# EAGLE design quadcopter_sch (EAGLE 7.7.0)
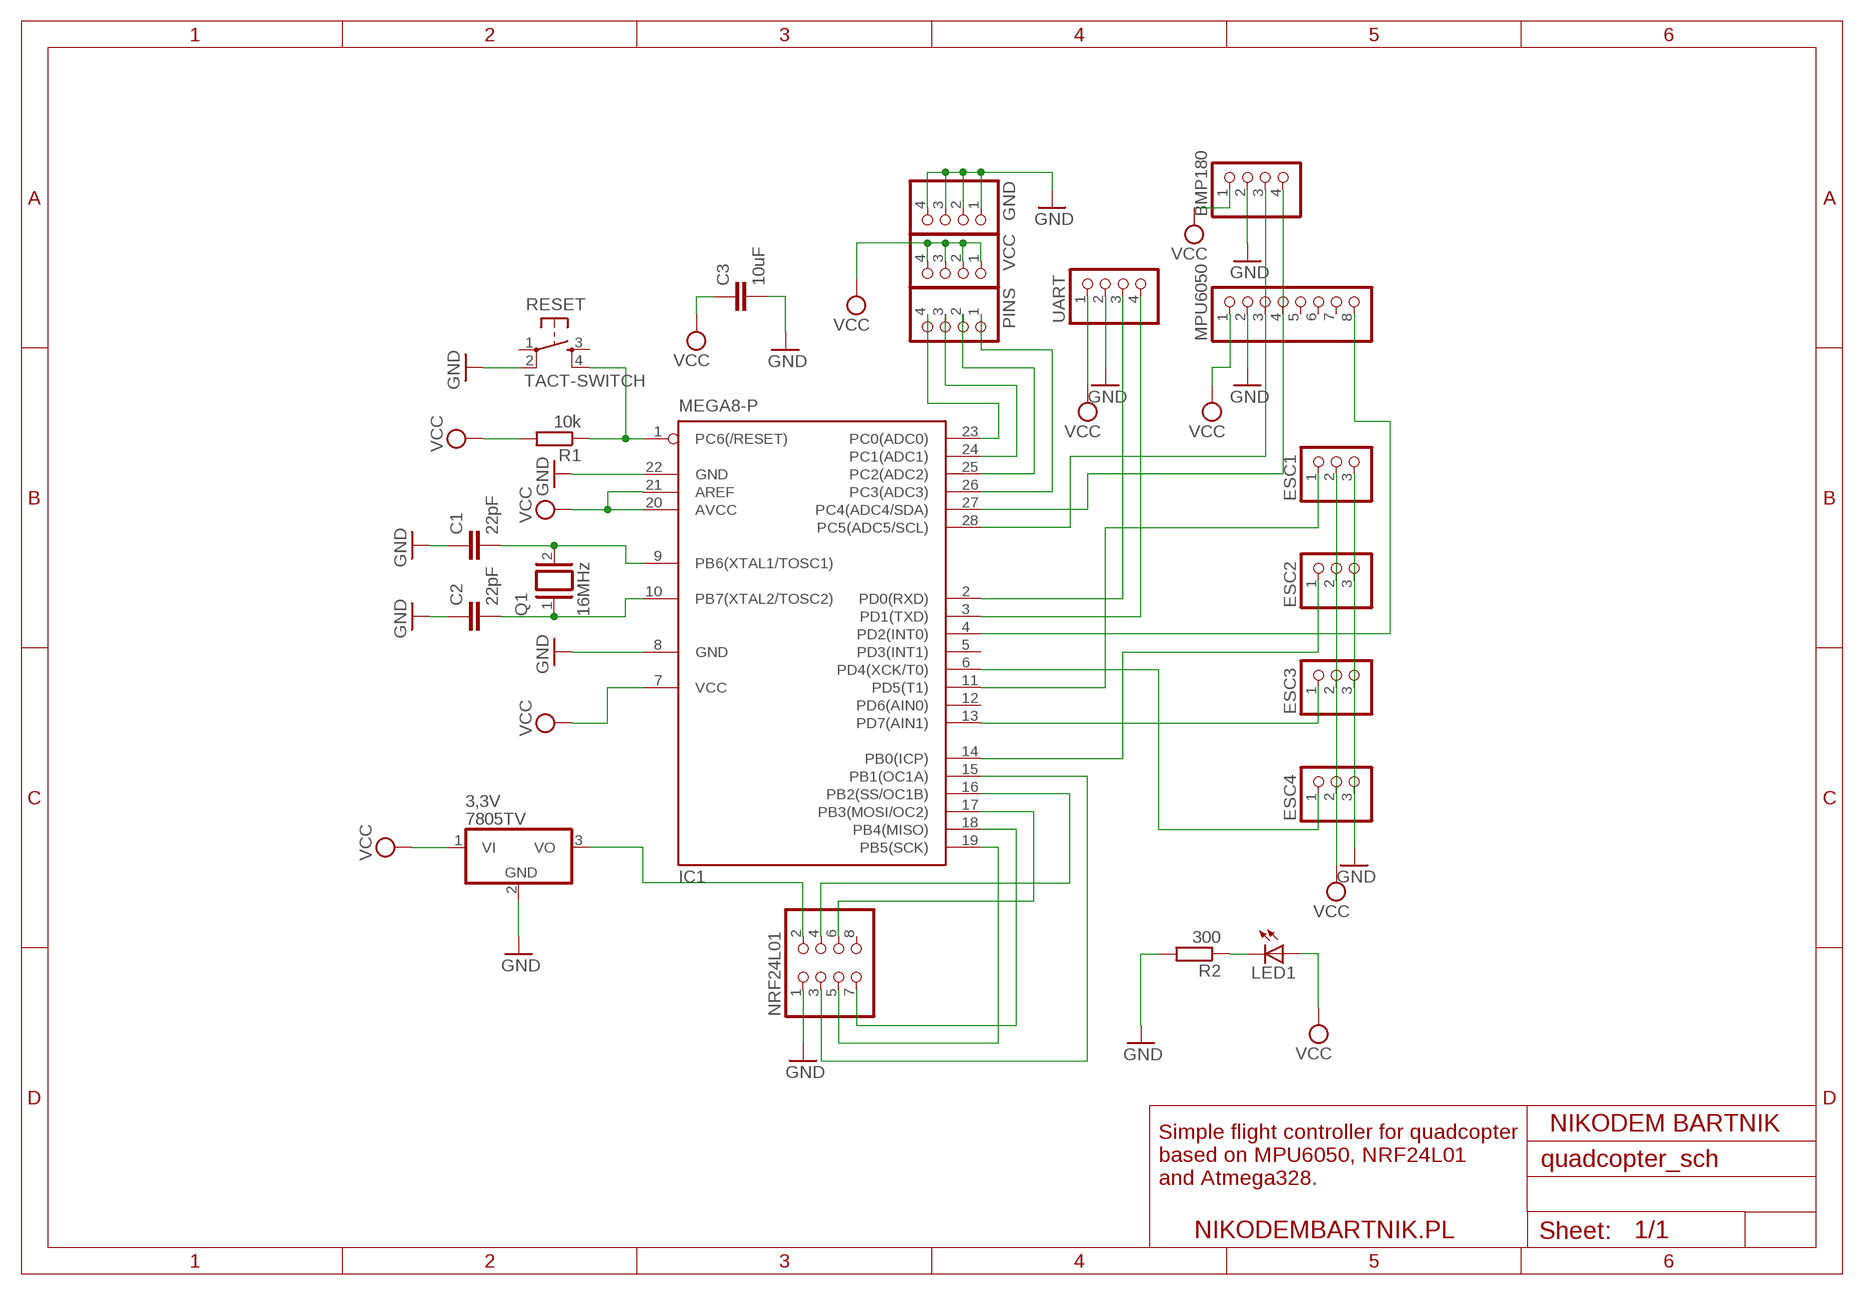
[diagram p0: schematic, sheet 1]

## Parts
3,3V  7805TV  [TO220V]
BMP180  PINHD-1X4  [1X04]
C1  22pF  C2,5-3  [C2.5-3]
C2  22pF  C2,5-3  [C2.5-3]
C3  10uF  C2,5-3  [C2.5-3]
ESC1  PINHD-1X3  [1X03]
ESC2  PINHD-1X3  [1X03]
ESC3  PINHD-1X3  [1X03]
ESC4  PINHD-1X3  [1X03]
GND  PINHD-1X4  [1X04]
IC1  MEGA8-P  [DIL28-3]
LED1  LED5MM  [LED5MM]
MPU6050  PINHD-1X8  [1X08]
NRF24L01  PINHD-2X4  [2X04]
PINS  PINHD-1X4  [1X04]
Q1  16MHz  XTAL/S  [QS]
R1  10k  R-EU_0204/2V  [0204V]
R2  300  R-EU_0204/2V  [0204V]
RESET  TACT-SWITCH  TACTILE-SWITCH-PTH  [TAC-SWITCH-PTH]
UART  PINHD-1X4  [1X04]
VCC  PINHD-1X4  [1X04]

## Nets
GND: 3,3V.2(GND) BMP180.2 C1.1 C2.1 C3.2 ESC1.3 ESC2.3 ESC3.3 ESC4.3 GND.1 GND.2 GND.3 GND.4 IC1.8(GND) IC1.22(GND) MPU6050.2 NRF24L01.1 R2.2 RESET.2 UART.2
N$1: IC1.1(PC6(/RESET)) R1.1 RESET.4
N$2: C1.2 IC1.9(PB6(XTAL1/TOSC1)) Q1.2
N$3: C2.2 IC1.10(PB7(XTAL2/TOSC2)) Q1.1
N$4: IC1.2(PD0(RXD)) UART.3
N$5: ESC1.1 IC1.11(PD5(T1))
N$6: ESC2.1 IC1.14(PB0(ICP))
N$7: ESC3.1 IC1.13(PD7(AIN1))
N$8: ESC4.1 IC1.6(PD4(XCK/T0))
N$9: IC1.3(PD1(TXD)) UART.4
N$10: BMP180.4 IC1.27(PC4(ADC4/SDA)) MPU6050.4
N$11: BMP180.3 IC1.28(PC5(ADC5/SCL)) MPU6050.3
N$12: IC1.4(PD2(INT0)) MPU6050.8
N$13: IC1.23(PC0(ADC0)) PINS.4
N$14: IC1.24(PC1(ADC1)) PINS.3
N$15: 3,3V.3(VO) NRF24L01.2
N$16: IC1.17(PB3(MOSI/OC2)) NRF24L01.6
N$17: IC1.18(PB4(MISO)) NRF24L01.7
N$18: IC1.19(PB5(SCK)) NRF24L01.5
N$19: IC1.15(PB1(OC1A)) NRF24L01.3
N$20: IC1.16(PB2(SS/OC1B)) NRF24L01.4
N$21: IC1.25(PC2(ADC2)) PINS.2
N$22: IC1.26(PC3(ADC3)) PINS.1
N$26: LED1.K(C) R2.1
VCC: 3,3V.1(VI) BMP180.1 C3.1 ESC1.2 ESC2.2 ESC3.2 ESC4.2 IC1.7(VCC) IC1.20(AVCC) IC1.21(AREF) LED1.A MPU6050.1 R1.2 UART.1 VCC.1 VCC.2 VCC.3 VCC.4
Unconnected: IC1.5(PD3(INT1)) IC1.12(PD6(AIN0)) MPU6050.5 MPU6050.6 MPU6050.7 NRF24L01.8 RESET.1 RESET.3

## Notes on the sheet
- NIKODEM BARTNIK
- Simple flight controller for quadcopter 
  based on MPU6050, NRF24L01
  and Atmega328.
- NIKODEMBARTNIK.PL

## Library data of the parts
3,3V = linear:78*: Positive VOLTAGE REGULATOR Source: http://cache.national.com/ds/LM/LM78L05.pdf http://www.fairchildsemi.com/ds/LM/LM7805.pdf
BMP180 GND PINS UART VCC = pinhead:PINHD-1X4: PIN HEADER
C1-C3 = capacitor-wima:C: CAPACITOR naming: grid - package width
ESC1-ESC4 = pinhead:PINHD-1X3: PIN HEADER
IC1 = atmel:MEGA8-P: MICROCONTROLLER 8 Kbytes FLASH, 1 kbytes SRAM, 512 bytes EEPROM, USART, 4-channel 10 bit ADC, 2-channel 8 bit ADC Pin compatible with Atmega48, ATMega88, ATMega168 Source: avr.lbr; OC_FARNELL: unknown; OC_NEWARK: unknown
LED1 = led:LED: LED OSRAM: - CHIPLED LG R971, LG N971, LY N971, LG Q971, LY Q971, LO R971, LY R971 LH N974, LH R974 LS Q976, LO Q976, LY Q976 LO Q996 - Hyper CHIPLED LW Q18S LB Q993, LB Q99A, LB R99A - SideLED LS A670, LO A670, LY A670, LG A670, LP A670 LB A673, LV A673, LT A673, LW A673 LH A674 LY A675 LS A676, LA A676, LO A676, LY A676, LW A676 LS A679, LY A679, LG A679 - Hyper Micro SIDELED® LS Y876, LA Y876, LO Y876, LY Y876 LT Y87S - SmartLED LW L88C, LW L88S LB L89C, LB L89S, LG L890 LS L89K, LO L89K, LY L89K LS L896, LA L896, LO L896, LY L896 - TOPLED LS T670, LO T670, LY T670, LG T670, LP T670 LSG T670, LSP T670, LSY T670, LOP T670, LYG T670 LG T671, LOG T671, LSG T671 LB T673, LV T673, LT T673, LW T673 LH T674 LS T676, LA T676, LO T676, LY T676, LB T676, LH T676, LSB T676, LW T676 LB T67C, LV T67C, LT T67C, LS T67K, LO T67K, LY T67K, LW E67C LS E67B, LA E67B, LO E67B, LY E67B, LB E67C, LV E67C, LT E67C LW T67C LS T679, LY T679, LG T679 LS T770, LO T770, LY T770, LG T770, LP T770 LB T773, LV T773, LT T773, LW T773 LH T774 LS E675, LA E675, LY E675, LS T675 LS T776, LA T776, LO T776, LY T776, LB T776 LHGB T686 LT T68C, LB T68C - Hyper Mini TOPLED® LB M676 - Mini TOPLED Santana® LG M470 LS M47K, LO M47K, LY M47K Source: http://www.osram.convergy.de LUXEON: - LUMILED® LXK2-PW12-R00, LXK2-PW12-S00, LXK2-PW14-U00, LXK2-PW14-V00 LXK2-PM12-R00, LXK2-PM12-S00, LXK2-PM14-U00 LXK2-PE12-Q00, LXK2-PE12-R00, LXK2-PE12-S00, LXK2-PE14-T00, LXK2-PE14-U00 LXK2-PB12-K00, LXK2-PB12-L00, LXK2-PB12-M00, LXK2-PB14-N00, LXK2-PB14-P00, LXK2-PB14-Q00 LXK2-PR12-L00, LXK2-PR12-M00, LXK2-PR14-Q00, LXK2-PR14-R00 LXK2-PD12-Q00, LXK2-PD12-R00, LXK2-PD12-S00 LXK2-PH12-R00, LXK2-PH12-S00 LXK2-PL12-P00, LXK2-PL12-Q00, LXK2-PL12-R00 Source: www.luxeon.com KINGBRIGHT: KA-3528ASYC Source: www.kingbright.com
MPU6050 = pinhead:PINHD-1X8: PIN HEADER
NRF24L01 = pinhead:PINHD-2X4: PIN HEADER
Q1 = special:XTAL/S: CRYSTAL
R1 R2 = resistor:R-EU_: RESISTOR, European symbol
RESET = GeekAmmo:TACTILE-SWITCH: Tactile Switch 4 Pins, SPST NO

## Net classes
0 default: width 0.381 mm, clearance 0.381 mm

## Board
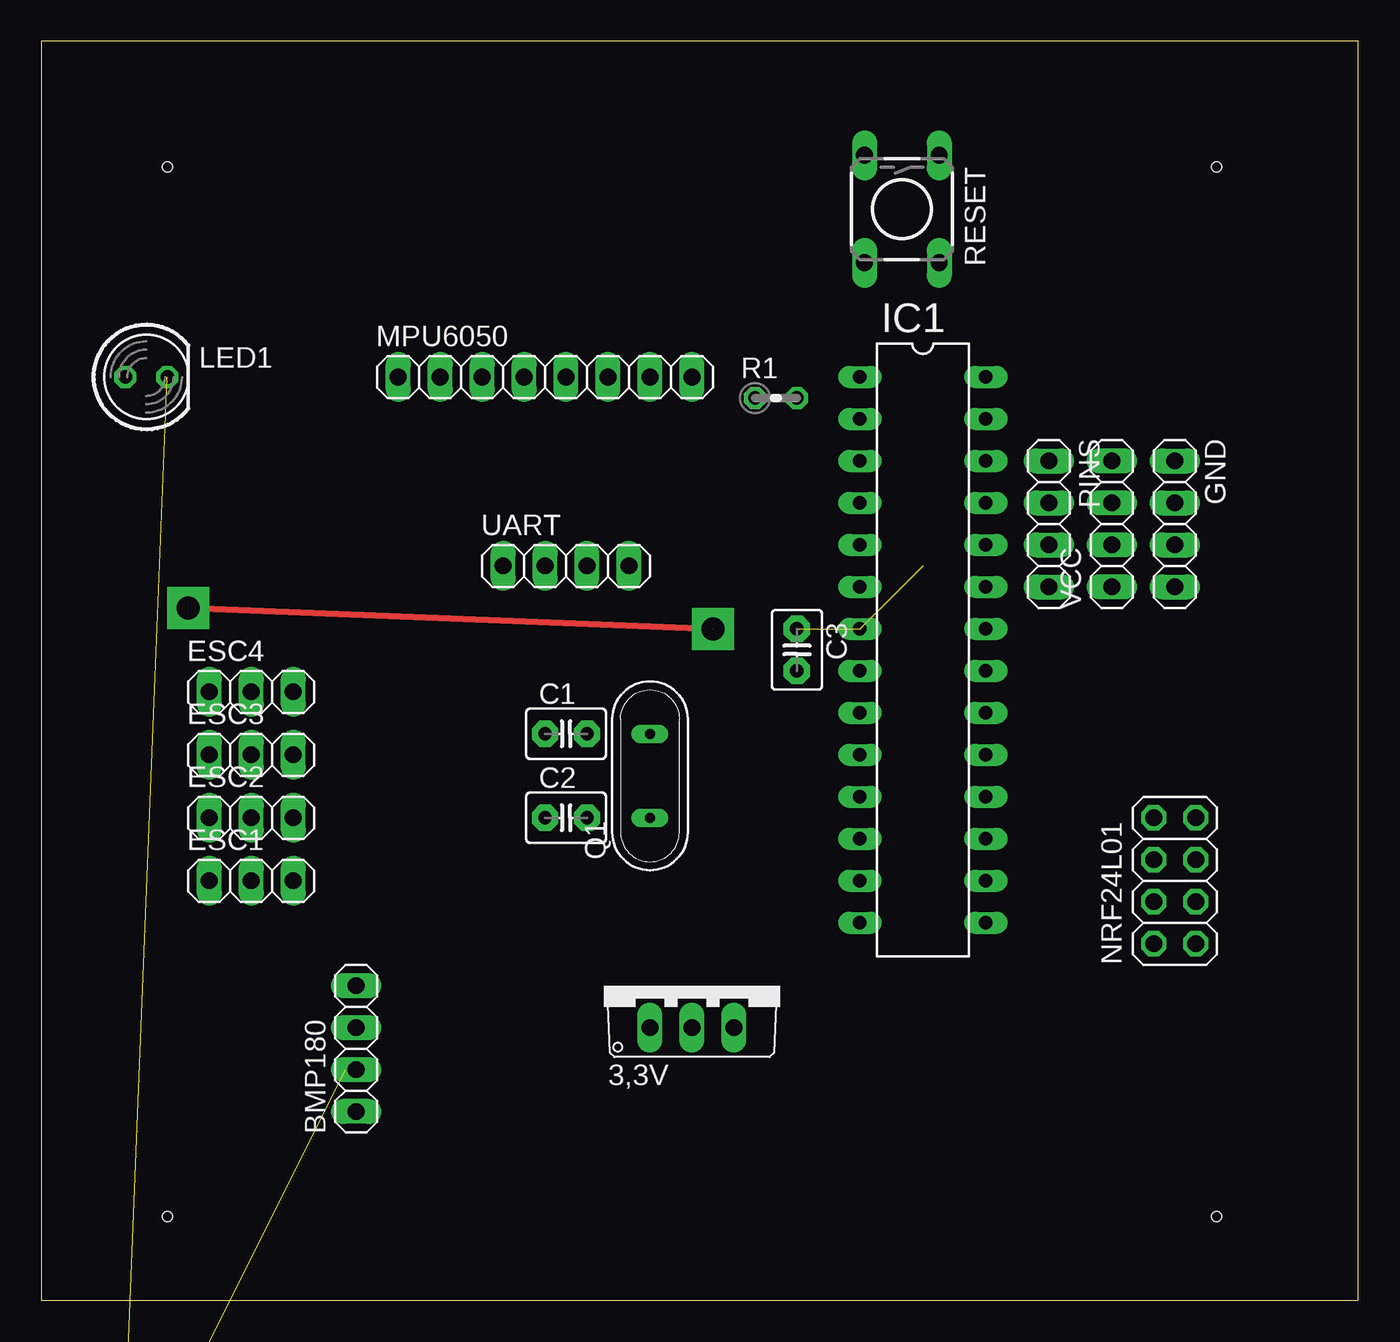
[diagram p1: board, top side]
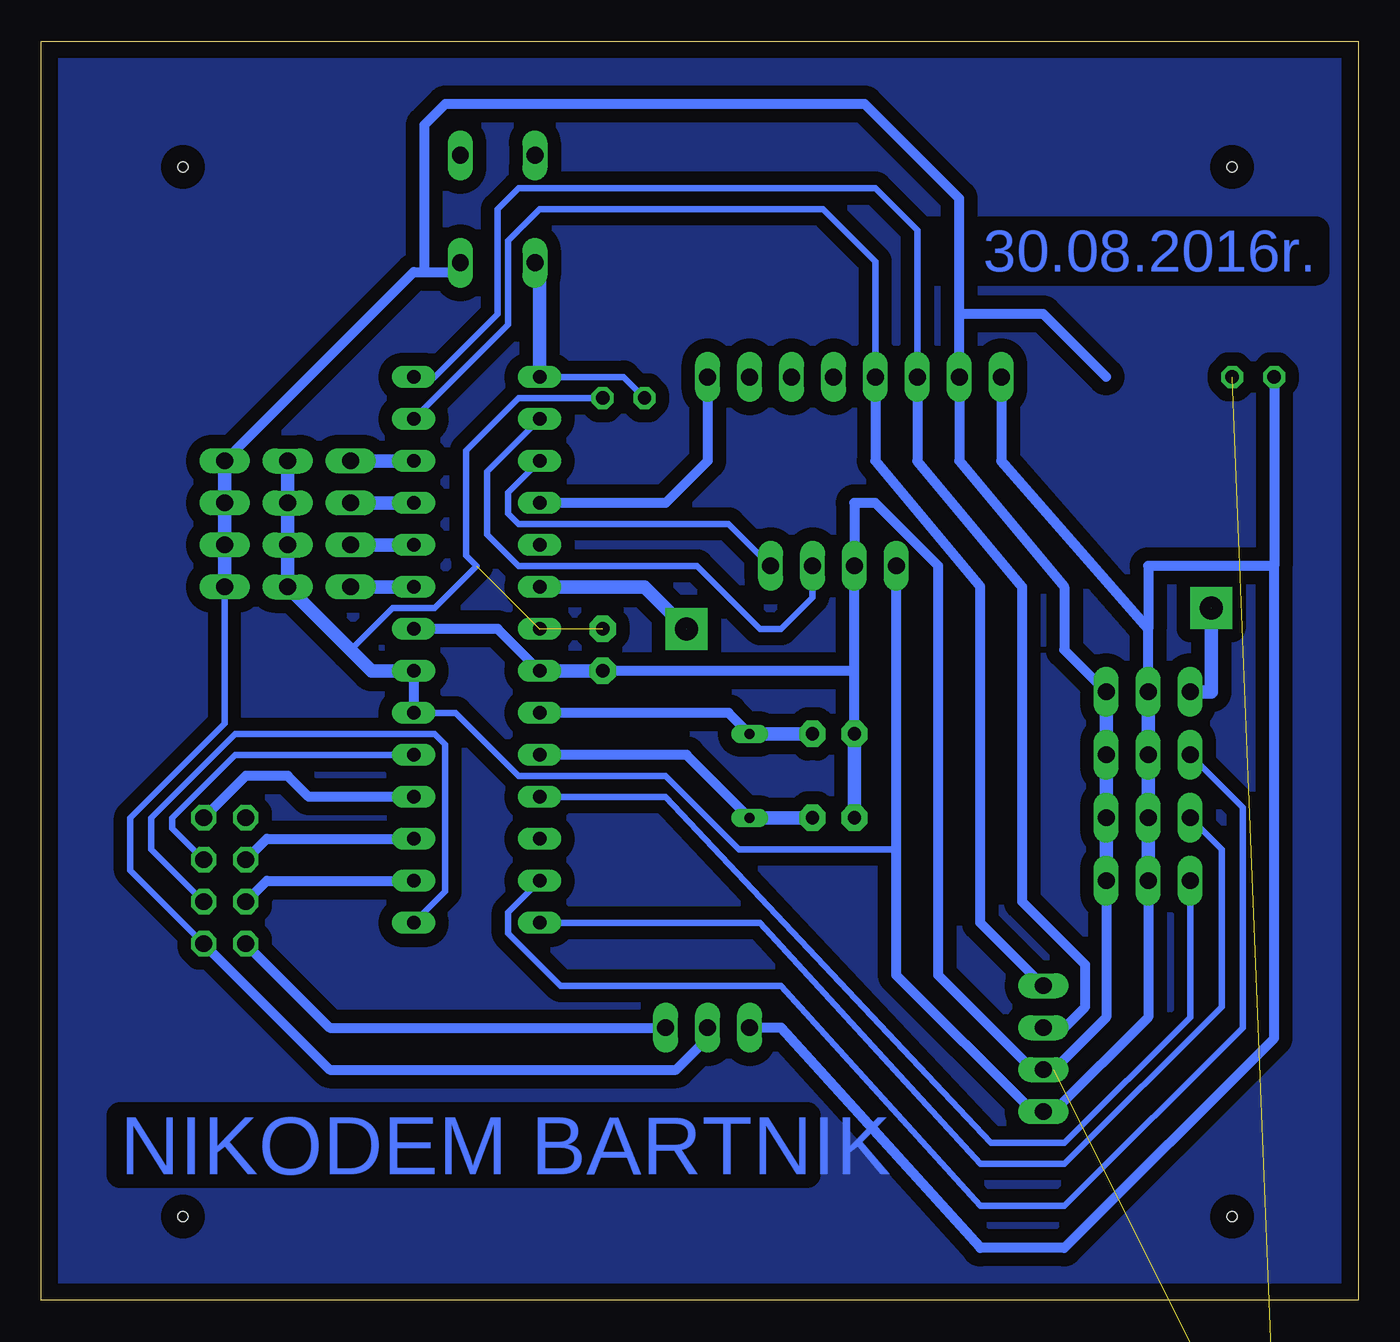
[diagram p2: board, bottom side, seen from below]

Size 79.68 x 76.19 mm. Coordinates in mm from the lower left corner, seen from the top.
Outline: 0,0 79.68,0 79.68,76.19 0,76.19 0,0
Copper layers (1*16): Top 0.035mm / dielectric 1.5mm / Bottom 0.035mm
Design rules "default": minimum track width 10mil, minimum drill 24mil, track to track 8mil, track to pad 8mil, pad to pad 8mil, via to via 8mil, smd to smd 8mil, copper to edge 40mil, drill to drill 8mil, minimum pad ring 10mil, minimum via ring 8mil, stop-mask expansion 4mil, vias tented up to drill 0mil, thermal gap 10mil
Holes 0.6 mm at 7.62,68.58 71.12,68.58 7.62,5.08 71.12,5.08

### Footprints (pad centres in the part's own frame; a part is rotated, then mirrored left to right if it is on the bottom)
TO220V = drill 1.016 long: 1 -2.54,-2.54; 2 0,-2.54; 3 2.54,-2.54
1X04 = drill 1.016 long: 1 -3.81,0; 2 -1.27,0; 3 1.27,0; 4 3.81,0
C2.5-3 = drill 0.813 pad 1.6 octagon: 1 -1.27,0; 2 1.27,0
1X03 = drill 1.016 long: 1 -2.54,0; 2 0,0; 3 2.54,0
DIL28-3 = drill 0.813 long: 1 -16.51,-3.81; 2 -13.97,-3.81; 3 -11.43,-3.81; 4 -8.89,-3.81; 5 -6.35,-3.81; 6 -3.81,-3.81; 7 -1.27,-3.81; 8 1.27,-3.81; 9 3.81,-3.81; 10 6.35,-3.81; 11 8.89,-3.81; 12 11.43,-3.81; 13 13.97,-3.81; 14 16.51,-3.81; 15 16.51,3.81; 16 13.97,3.81; 17 11.43,3.81; 18 8.89,3.81; 19 6.35,3.81; 20 3.81,3.81; 21 1.27,3.81; 22 -1.27,3.81; 23 -3.81,3.81; 24 -6.35,3.81; 25 -8.89,3.81; 26 -11.43,3.81; 27 -13.97,3.81; 28 -16.51,3.81
LED5MM = drill 0.813 octagon: A -1.27,0; K 1.27,0
1X08 = drill 1.016 long: 1 -8.89,0; 2 -6.35,0; 3 -3.81,0; 4 -1.27,0; 5 1.27,0; 6 3.81,0; 7 6.35,0; 8 8.89,0
2X04 = drill 1.016 octagon: 1 -3.81,-1.27; 2 -3.81,1.27; 3 -1.27,-1.27; 4 -1.27,1.27; 5 1.27,-1.27; 6 1.27,1.27; 7 3.81,-1.27; 8 3.81,1.27
QS = drill 0.61 long: 1 -2.54,0; 2 2.54,0
0204V = drill 0.813 octagon: 1 -1.27,0; 2 1.27,0
TAC-SWITCH-PTH = drill 1.016 pad 1.524 long: 1 -3.251,2.261; 2 3.251,2.261; 3 -3.251,-2.261; 4 3.251,-2.261

### Placement (x,y rotation side)
3,3V  39.37,19.05 0 top
BMP180  19.05,15.24 90 top
C1  31.75,34.29 0 top
C2  31.75,29.21 0 top
C3  45.72,39.37 270 top
ESC1  12.7,25.4 0 top
ESC2  12.7,29.21 0 top
ESC3  12.7,33.02 0 top
ESC4  12.7,36.83 0 top
GND  68.58,46.99 270 top
IC1  53.34,39.37 270 top
LED1  6.35,55.88 0 top
MPU6050  30.48,55.88 0 top
NRF24L01  68.58,25.4 90 top
PINS  60.96,46.99 270 top
Q1  36.83,31.75 90 top
R1  44.45,54.61 0 top
R2  6.35,-7.62 0 top  (outside the outline)
RESET  52.07,66.04 270 top
UART  31.75,44.45 0 top
VCC  64.77,46.99 90 top

### Tracks (layer width: path | path; a pad name or v marks a point on that pad's centre or on a via)
GND  (1 unrouted)
  Bottom 0.381: GND.4 68.58,34.92 74.3,29.21 74.3,26.03 NRF24L01.1 | 30.48,43.81 UART.2
  Bottom 0.61: 56.52,62.23 57.15,62.23 GND.1 | 56.52,62.23 54.61,62.23 RESET.2 | 3,3V.2 39.37,15.88 41.28,13.97 62.23,13.97 NRF24L01.1 | IC1.22 52.07,40.64 IC1.8 | C1.1 30.48,38.1 | 30.48,38.1 UART.2 30.48,48.26 29.21,48.26 25.4,44.45 25.4,19.69 19.68,13.97 BMP180.2 18.41,13.97 15.24,17.14 ESC1.3 | 30.48,38.1 C3.2 | 56.52,62.23 56.52,71.12 55.25,72.39 29.85,72.39 24.13,66.67 24.13,59.69 | 24.13,59.69 MPU6050.2 24.13,50.8 17.78,43.18 17.78,39.37 ESC4.3 | 15.24,55.88 19.05,59.69 24.13,59.69
  Bottom 0.813: GND.4 GND.3 GND.2 GND.1 | C3.2 IC1.8 | C1.1 C2.1 | ESC1.3 ESC2.3 ESC3.3 ESC4.3
N$1
  Bottom 0.381: R1.1 44.45,55.88 IC1.1
  Bottom 0.813: IC1.1 49.53,62.23 RESET.4
N$2
  Bottom 0.61: IC1.9 38.1,35.56 Q1.2
  Bottom 0.813: C1.2 Q1.2
N$3
  Bottom 0.61: IC1.10 40.64,33.02 Q1.1
  Bottom 0.813: C2.2 Q1.1
N$4
  Bottom 0.381: IC1.2 52.71,50.16 52.71,46.35 50.8,44.45 40.01,44.45 36.2,40.64 34.93,40.64 33.02,42.55 UART.3
N$5
  Bottom 0.381: IC1.11 41.91,30.48 22.22,9.53 17.78,9.53 10.16,17.14 ESC1.1
N$6
  Bottom 0.381: IC1.14 36.2,22.86 22.86,8.25 17.78,8.25 8.25,17.78 8.25,27.3 ESC2.1
N$7
  Bottom 0.381: IC1.13 51.44,23.49 51.44,22.23 48.26,19.05 34.93,19.05 22.86,5.71 17.78,5.71 6.99,16.51 6.99,29.84 ESC3.1
N$8  (2 unrouted)
  Top 0.406: 40.64,40.64 8.89,41.91
  Bottom 0.813: IC1.6 43.18,43.18 40.64,40.64 | ESC4.1 8.89,36.83 8.89,41.91
N$9
  Bottom 0.381: IC1.3 51.44,48.89 51.44,47.62 50.8,46.99 38.1,46.99 UART.4
N$10
  Bottom 0.381: IC1.27 51.44,59.05 51.44,64.14 49.53,66.04 32.39,66.04 29.21,62.86 MPU6050.4
  Bottom 0.61: BMP180.4 22.86,22.86 22.86,43.18 29.21,50.8 MPU6050.4
N$11
  Bottom 0.406: IC1.28 55.88,55.88 52.07,59.69 52.07,66.04 50.8,67.31 29.21,67.31 26.67,64.77 MPU6050.3
  Bottom 0.61: BMP180.3 18.41,16.51 17.78,16.51 16.51,17.78 16.51,20.32 20.32,24.13 20.32,43.18 26.67,50.8 MPU6050.3
N$12
  Bottom 0.61: MPU6050.8 39.37,50.8 41.91,48.26 IC1.4
N$13
  Bottom 0.813: PINS.4 IC1.23
N$14
  Bottom 0.813: PINS.3 IC1.24
N$15
  Bottom 0.61: 3,3V.3 62.23,16.51 NRF24L01.2
N$16
  Bottom 0.61: IC1.17 66.04,27.94 NRF24L01.6
N$17
  Bottom 0.61: IC1.18 63.5,30.48 64.77,31.75 67.31,31.75 NRF24L01.7
N$18
  Bottom 0.381: IC1.19 67.94,33.02 71.75,29.21 71.75,28.58 NRF24L01.5
N$19
  Bottom 0.381: IC1.15 55.25,24.77 55.25,33.66 55.88,34.29 67.94,34.29 73.02,29.21 73.02,27.3 NRF24L01.3
N$20
  Bottom 0.61: IC1.16 66.04,25.4 NRF24L01.4
N$21
  Bottom 0.813: PINS.2 IC1.25
N$22
  Bottom 0.813: PINS.1 IC1.26
N$23  (via drill 1.4 pad 2.54)
  other vias: 40.64,40.64
N$24  (via drill 1.4 pad 2.54)
  other vias: 8.89,41.91
N$25
  pour Bottom (isolate 0.813): 0,76.2 0,0 80.01,0 80.01,76.2
N$26  (1 unrouted)
VCC  (2 unrouted)
  Bottom 0.381: R1.2 50.8,54.61 53.98,51.43 53.98,45.09 53.34,44.45 55.88,41.91 58.42,41.91 60.96,39.37 | IC1.20 54.61,35.56 50.8,31.75 41.91,31.75 37.47,27.3 27.94,27.3
  Bottom 0.61: 3,3V.1 34.93,16.51 22.86,3.17 17.78,3.17 5.08,15.88 5.08,44.45 | IC1.21 IC1.20 | ESC1.2 12.7,17.14 18.41,11.43 BMP180.1 19.68,11.43 27.94,19.69 27.94,27.3 UART.1 | MPU6050.1 21.59,50.8 12.7,40.64 | ESC4.2 12.7,40.64 | 5.08,44.45 12.7,44.45 12.7,40.64 | LED1.A 5.08,44.45
  Bottom 0.813: ESC4.2 ESC3.2 ESC2.2 ESC1.2 | VCC.4 VCC.3 VCC.2 VCC.1 60.96,39.37 59.69,38.1 IC1.21

### Text on the board
Bottom: 30.08.2016r. | NIKODEM BARTNIK